# Altium schematic sheet 06_PWM_IO.SchDoc
size A4
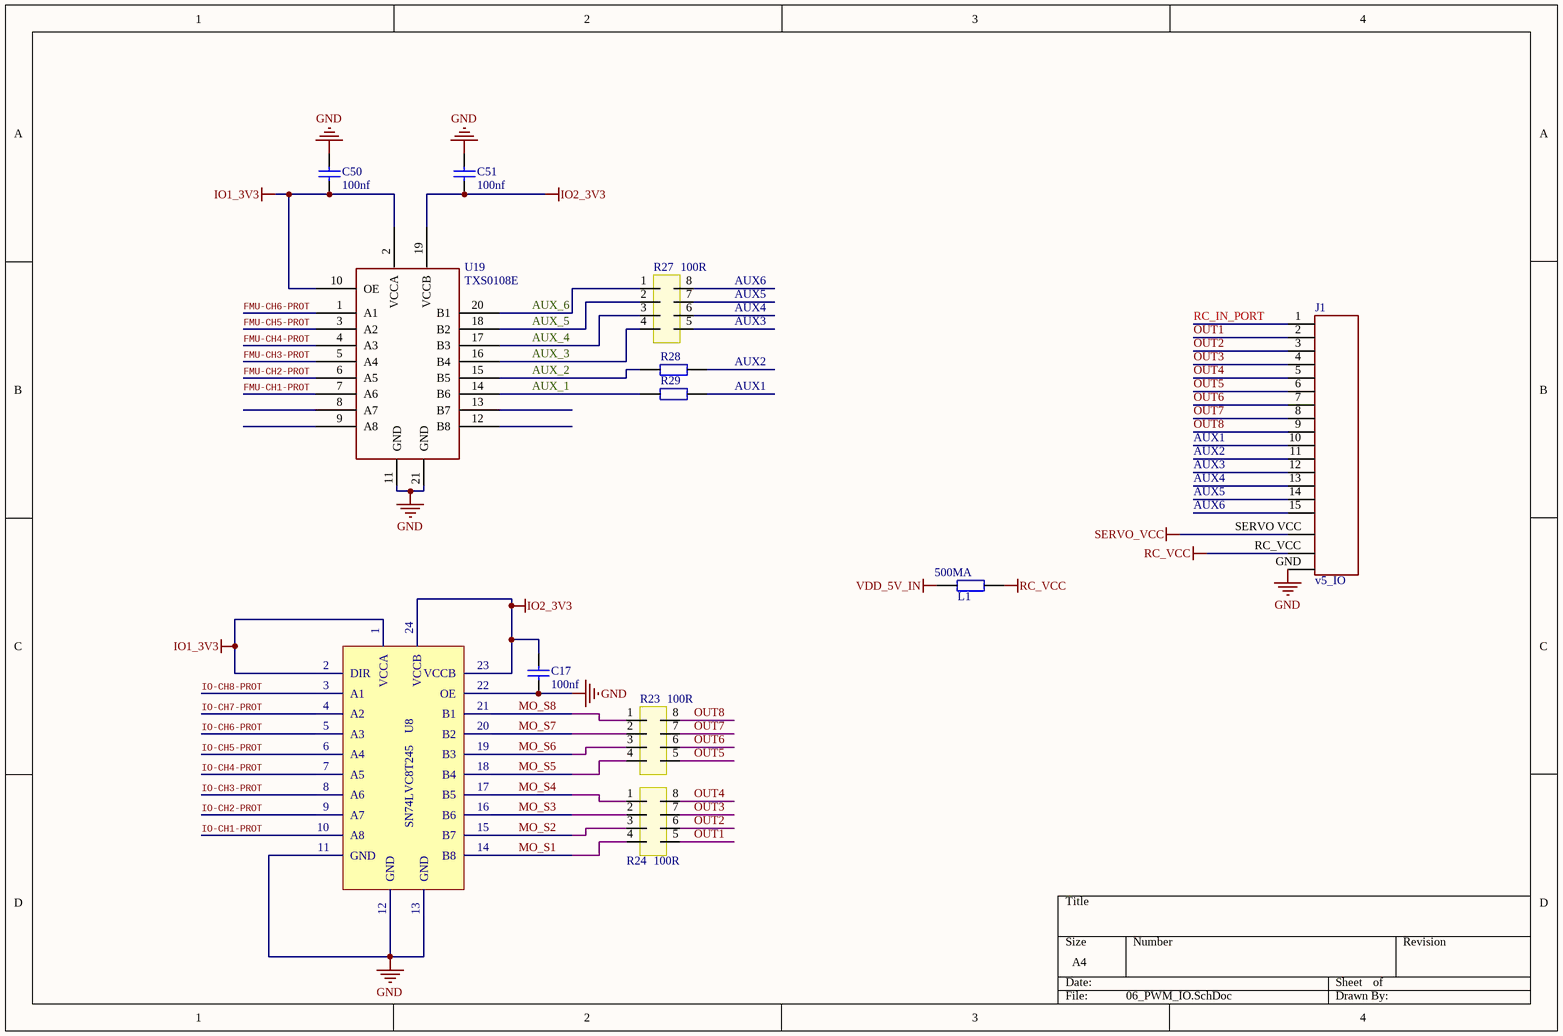
[diagram p0: 06_PWM_IO.SchDoc]

## Parts
C17  100nf  [0402CAP]
C50  100nf  [0402CAP]
C51  100nf  [0402CAP]
J1  v5_IO  [V5_IO_PWM]
L1  500MA  [0805l]
R23  100R  [0402_4r]
R24  100R  [0402_4r]
R27  100R  [0402_4r]
R28  0402R100R  [0402R]  (value not drawn)
R29  0402R100R  [0402R]  (value not drawn)
U8  SN74LVC8T245  [QFN24-RGY]
U19  TXS0108E  [VQFN20]

## Nets
GND: C17.1 C50.1 C51.1 J1.GND U8.11(GND) U8.12(GND) U8.13(GND) U8.22(OE) U19.11(GND) U19.21(GND)
IO1_3V3: C50.2 U8.1(VCCA) U8.2(DIR) U19.2(VCCA) U19.10(OE)
IO2_3V3: C17.2 C51.2 U8.23(VCCB) U8.24(VCCB) U19.19(VCCB)
RC_VCC: J1.RC_VCC L1.1
SERVO_VCC: J1.SERVO_VCC
VDD_5V_IN: L1.2
AUX1: J1.10 R29.2
AUX2: J1.11 R28.2
AUX3: J1.12 R27.5
AUX4: J1.13 R27.6
AUX5: J1.14 R27.7
AUX6: J1.15 R27.8
AUX_1: R29.1 U19.14(B6)
AUX_2: R28.1 U19.15(B5)
AUX_3: R27.4 U19.16(B4)
AUX_4: R27.3 U19.17(B3)
AUX_5: R27.2 U19.18(B2)
AUX_6: R27.1 U19.20(B1)
FMU-CH1-PROT: U19.7(A6)
FMU-CH2-PROT: U19.6(A5)
FMU-CH3-PROT: U19.5(A4)
FMU-CH4-PROT: U19.4(A3)
FMU-CH5-PROT: U19.3(A2)
FMU-CH6-PROT: U19.1(A1)
IO-CH1-PROT: U8.10(A8)
IO-CH2-PROT: U8.9(A7)
IO-CH3-PROT: U8.8(A6)
IO-CH4-PROT: U8.7(A5)
IO-CH5-PROT: U8.6(A4)
IO-CH6-PROT: U8.5(A3)
IO-CH7-PROT: U8.4(A2)
IO-CH8-PROT: U8.3(A1)
MO_S1: R24.4 U8.14(B8)
MO_S2: R24.3 U8.15(B7)
MO_S3: R24.2 U8.16(B6)
MO_S4: R24.1 U8.17(B5)
MO_S5: R23.4 U8.18(B4)
MO_S6: R23.3 U8.19(B3)
MO_S7: R23.2 U8.20(B2)
MO_S8: R23.1 U8.21(B1)
OUT1: J1.2 R24.5
OUT2: J1.3 R24.6
OUT3: J1.4 R24.7
OUT4: J1.5 R24.8
OUT5: J1.6 R23.5
OUT6: J1.7 R23.6
OUT7: J1.8 R23.7
OUT8: J1.9 R23.8
RC_IN_PORT: J1.1

Not connected (* = marked no-connect by the designer): U19 8(A7) 9(A8) 12(B8) 13(B7)

## Library data of the parts
C17 = Cap: Value: 100pF; Published: 8-Jun-2000; LatestRevisionDate: 17-Jul-2002; LatestRevisionNote: Re-released for DXP Platform.; PackageReference: RAD-0.3; Publisher: Altium Limited; PackageDescription: Radial Cap, Thru-Hole; 2 Leads; 0.3 in Pin Spacing
C50 C51 = Cap
L1 R28 R29 = 0402R100R: 0402R100R 1%
R23 R24 R27 = 0402-8R-4R